# EasyEDA schematic diagram.json
TITLE: 控制面板; REV: 1.0; Date: 2023-10-11; Sheet: 1/1; Drawn By: ltw8086; Company: OIer-Meet Team
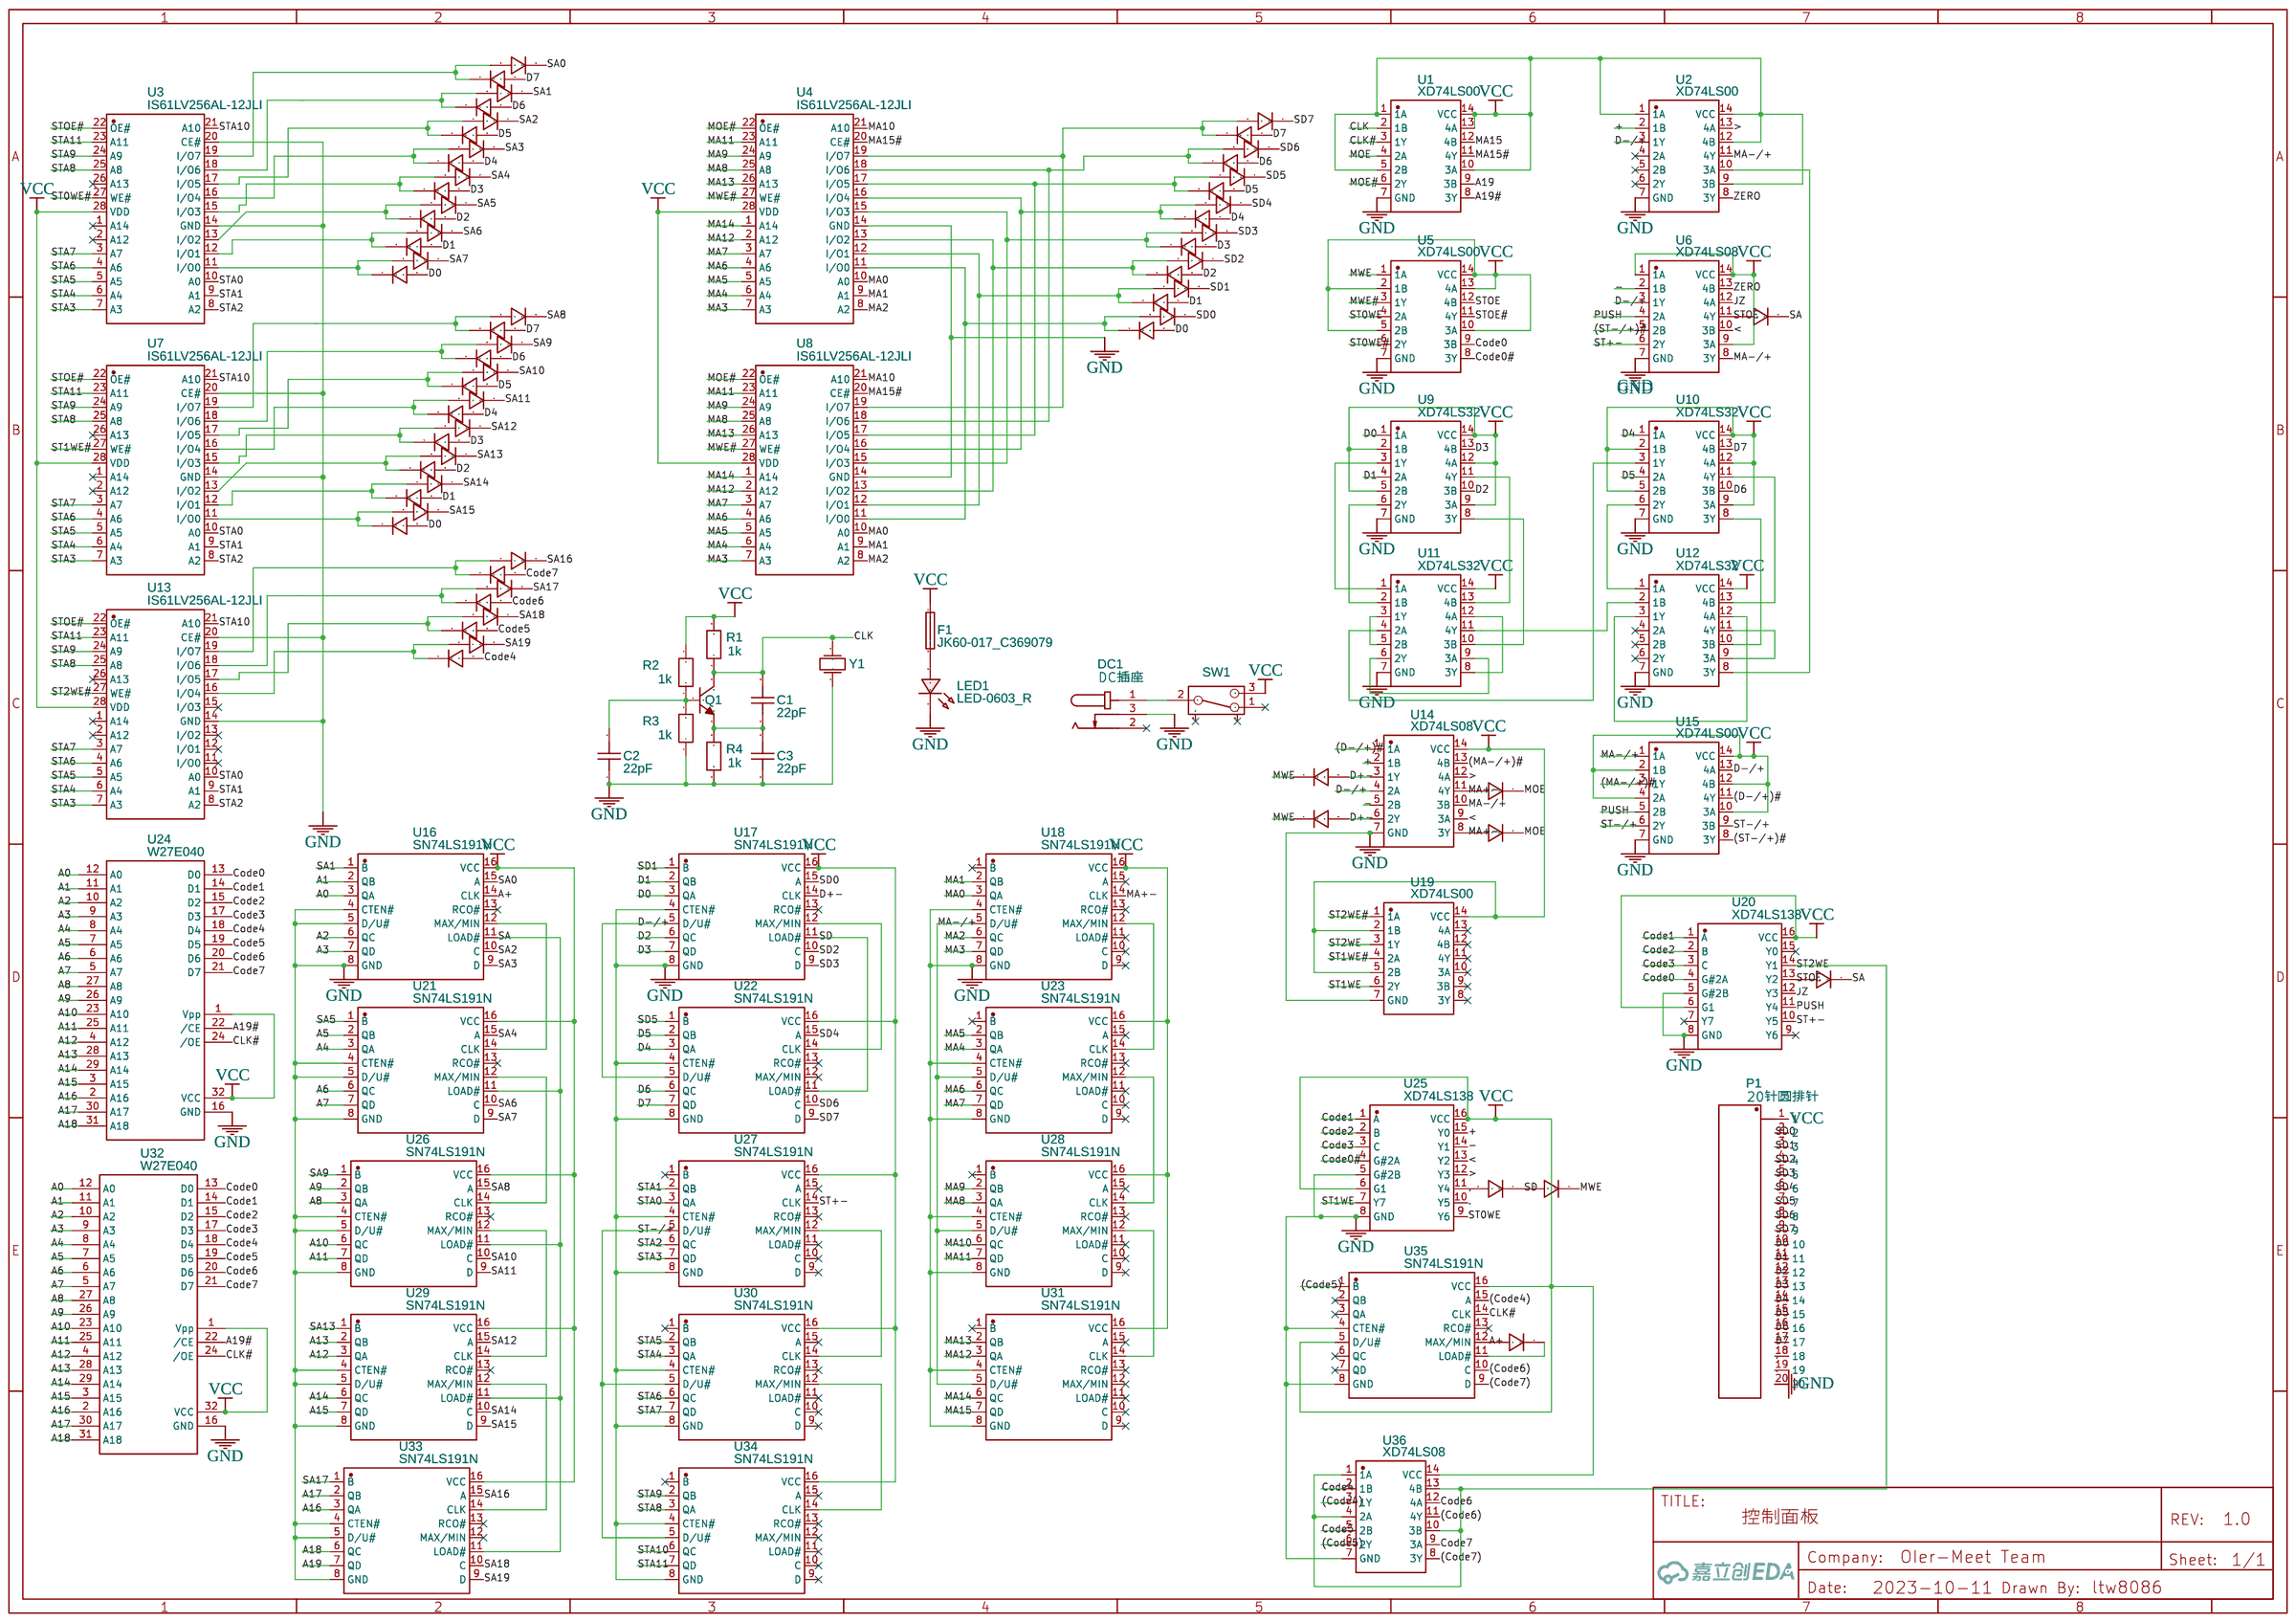
[diagram p0: schematic sheet]

## Parts
C1  22pF  [RAD-0.1]
C2  22pF  [RAD-0.1]
C3  22pF  [RAD-0.1]
D1  1N4148  [DO-35_BD2.0-L4.2-P8.20-D0.5-RD]
D2  1N4148  [DO-35_BD2.0-L4.2-P8.20-D0.5-RD]
D3  1N4148  [DO-35_BD2.0-L4.2-P8.20-D0.5-RD]
D4  1N4148  [DO-35_BD2.0-L4.2-P8.20-D0.5-RD]
D5  1N4148  [DO-35_BD2.0-L4.2-P8.20-D0.5-RD]
D6  1N4148  [DO-35_BD2.0-L4.2-P8.20-D0.5-RD]
D7  1N4148  [DO-35_BD2.0-L4.2-P8.20-D0.5-RD]
D8  1N4148  [DO-35_BD2.0-L4.2-P8.20-D0.5-RD]
D9  1N4148  [DO-35_BD2.0-L4.2-P8.20-D0.5-RD]
D10  1N4148  [DO-35_BD2.0-L4.2-P8.20-D0.5-RD]
D11  1N4148  [DO-35_BD2.0-L4.2-P8.20-D0.5-RD]
D12  1N4148  [DO-35_BD2.0-L4.2-P8.20-D0.5-RD]
D13  1N4148  [DO-35_BD2.0-L4.2-P8.20-D0.5-RD]
D14  1N4148  [DO-35_BD2.0-L4.2-P8.20-D0.5-RD]
D15  1N4148  [DO-35_BD2.0-L4.2-P8.20-D0.5-RD]
D16  1N4148  [DO-35_BD2.0-L4.2-P8.20-D0.5-RD]
D17  1N4148  [DO-35_BD2.0-L4.2-P8.20-D0.5-RD]
D18  1N4148  [DO-35_BD2.0-L4.2-P8.20-D0.5-RD]
D19  1N4148  [DO-35_BD2.0-L4.2-P8.20-D0.5-RD]
D20  1N4148  [DO-35_BD2.0-L4.2-P8.20-D0.5-RD]
D21  1N4148  [DO-35_BD2.0-L4.2-P8.20-D0.5-RD]
D22  1N4148  [DO-35_BD2.0-L4.2-P8.20-D0.5-RD]
D23  1N4148  [DO-35_BD2.0-L4.2-P8.20-D0.5-RD]
D24  1N4148  [DO-35_BD2.0-L4.2-P8.20-D0.5-RD]
D25  1N4148  [DO-35_BD2.0-L4.2-P8.20-D0.5-RD]
D26  1N4148  [DO-35_BD2.0-L4.2-P8.20-D0.5-RD]
D27  1N4148  [DO-35_BD2.0-L4.2-P8.20-D0.5-RD]
D28  1N4148  [DO-35_BD2.0-L4.2-P8.20-D0.5-RD]
D29  1N4148  [DO-35_BD2.0-L4.2-P8.20-D0.5-RD]
D30  1N4148  [DO-35_BD2.0-L4.2-P8.20-D0.5-RD]
D31  1N4148  [DO-35_BD2.0-L4.2-P8.20-D0.5-RD]
D32  1N4148  [DO-35_BD2.0-L4.2-P8.20-D0.5-RD]
D33  1N4148  [DO-35_BD2.0-L4.2-P8.20-D0.5-RD]
D34  1N4148  [DO-35_BD2.0-L4.2-P8.20-D0.5-RD]
D35  1N4148  [DO-35_BD2.0-L4.2-P8.20-D0.5-RD]
D36  1N4148  [DO-35_BD2.0-L4.2-P8.20-D0.5-RD]
D37  1N4148  [DO-35_BD2.0-L4.2-P8.20-D0.5-RD]
D38  1N4148  [DO-35_BD2.0-L4.2-P8.20-D0.5-RD]
D39  1N4148  [DO-35_BD2.0-L4.2-P8.20-D0.5-RD]
D40  1N4148  [DO-35_BD2.0-L4.2-P8.20-D0.5-RD]
D41  1N4148  [DO-35_BD2.0-L4.2-P8.20-D0.5-RD]
D42  1N4148  [DO-35_BD2.0-L4.2-P8.20-D0.5-RD]
D43  1N4148  [DO-35_BD2.0-L4.2-P8.20-D0.5-RD]
D44  1N4148  [DO-35_BD2.0-L4.2-P8.20-D0.5-RD]
D45  1N4148  [DO-35_BD2.0-L4.2-P8.20-D0.5-RD]
D46  1N4148  [DO-35_BD2.0-L4.2-P8.20-D0.5-RD]
D47  1N4148  [DO-35_BD2.0-L4.2-P8.20-D0.5-RD]
D48  1N4148  [DO-35_BD2.0-L4.2-P8.20-D0.5-RD]
D49  1N4148  [DO-35_BD2.0-L4.2-P8.20-D0.5-RD]
D50  1N4148  [DO-35_BD2.0-L4.2-P8.20-D0.5-RD]
D51  1N4148  [DO-35_BD2.0-L4.2-P8.20-D0.5-RD]
D52  1N4148  [DO-35_BD2.0-L4.2-P8.20-D0.5-RD]
D53  1N4148  [DO-35_BD2.0-L4.2-P8.20-D0.5-RD]
D54  1N4148  [DO-35_BD2.0-L4.2-P8.20-D0.5-RD]
D55  1N4148  [DO-35_BD2.0-L4.2-P8.20-D0.5-RD]
D56  1N4148  [DO-35_BD2.0-L4.2-P8.20-D0.5-RD]
D57  1N4148  [DO-35_BD2.0-L4.2-P8.20-D0.5-RD]
D58  1N4148  [DO-35_BD2.0-L4.2-P8.20-D0.5-RD]
D62  1N4148  [DO-35_BD2.0-L4.2-P8.20-D0.5-RD]
D63  1N4148  [DO-35_BD2.0-L4.2-P8.20-D0.5-RD]
D64  1N4148  [DO-35_BD2.0-L4.2-P8.20-D0.5-RD]
D65  1N4148  [DO-35_BD2.0-L4.2-P8.20-D0.5-RD]
D66  1N4148  [DO-35_BD2.0-L4.2-P8.20-D0.5-RD]
D67  1N4148  [DO-35_BD2.0-L4.2-P8.20-D0.5-RD]
D68  1N4148  [DO-35_BD2.0-L4.2-P8.20-D0.5-RD]
DC1  DC插座  [DC-IN-TH_DC-005-5A-2.0]
F1  JK60-017_C369079  [FUSE-TH_L7.4-W3.0-P5.10-D0.5-S2.00]
LED1  LED-0603_R  [LED-TH_2P-L4.80-W3.80-P2.54-L]
P1  20针圆排针  [20针排针]
Q1  2N3904(TO-92)  [TO-92-3_L5.1-W4.1-P1.27-L]
R1  1k  [R_AXIAL-0.3]
R2  1k  [R_AXIAL-0.3]
R3  1k  [R_AXIAL-0.3]
R4  1k  [R_AXIAL-0.3]
SW1  SK-12D02-VG5  [SW-TH_SK-12D02VG3]
U1  XD74LS00  [DIP-14_L20.0-W7.6-P2.54-LS7.6-BL]
U2  XD74LS00  [DIP-14_L20.0-W7.6-P2.54-LS7.6-BL]
U3  IS61LV256AL-12JLI  [TSOP-28_L11.8-W8.0-P0.55-LS13.4-L]
U4  IS61LV256AL-12JLI  [TSOP-28_L11.8-W8.0-P0.55-LS13.4-L]
U5  XD74LS00  [DIP-14_L20.0-W7.6-P2.54-LS7.6-BL]
U6  XD74LS08  [DIP-14_L19.4-W6.4-P2.54-LS7.6-BL]
U7  IS61LV256AL-12JLI  [TSOP-28_L11.8-W8.0-P0.55-LS13.4-L]
U8  IS61LV256AL-12JLI  [TSOP-28_L11.8-W8.0-P0.55-LS13.4-L]
U9  XD74LS32  [DIP-14_L18.9-W6.4-P2.54-LS7.6-BL]
U10  XD74LS32  [DIP-14_L18.9-W6.4-P2.54-LS7.6-BL]
U11  XD74LS32  [DIP-14_L18.9-W6.4-P2.54-LS7.6-BL]
U12  XD74LS32  [DIP-14_L18.9-W6.4-P2.54-LS7.6-BL]
U13  IS61LV256AL-12JLI  [TSOP-28_L11.8-W8.0-P0.55-LS13.4-L]
U14  XD74LS08  [DIP-14_L19.4-W6.4-P2.54-LS7.6-BL]
U15  XD74LS00  [DIP-14_L20.0-W7.6-P2.54-LS7.6-BL]
U16  SN74LS191N  [PDIP-16_L19.3-W6.4-P2.54-LS7.94-BL]
U17  SN74LS191N  [PDIP-16_L19.3-W6.4-P2.54-LS7.94-BL]
U18  SN74LS191N  [PDIP-16_L19.3-W6.4-P2.54-LS7.94-BL]
U19  XD74LS00  [DIP-14_L20.0-W7.6-P2.54-LS7.6-BL]
U20  XD74LS138  [DIP-16_L19.8-W6.5-P2.54-LS7.6-BL]
U21  SN74LS191N  [PDIP-16_L19.3-W6.4-P2.54-LS7.94-BL]
U22  SN74LS191N  [PDIP-16_L19.3-W6.4-P2.54-LS7.94-BL]
U23  SN74LS191N  [PDIP-16_L19.3-W6.4-P2.54-LS7.94-BL]
U24  W27E040  [DIP32]
U25  XD74LS138  [DIP-16_L19.8-W6.5-P2.54-LS7.6-BL]
U26  SN74LS191N  [PDIP-16_L19.3-W6.4-P2.54-LS7.94-BL]
U27  SN74LS191N  [PDIP-16_L19.3-W6.4-P2.54-LS7.94-BL]
U28  SN74LS191N  [PDIP-16_L19.3-W6.4-P2.54-LS7.94-BL]
U29  SN74LS191N  [PDIP-16_L19.3-W6.4-P2.54-LS7.94-BL]
U30  SN74LS191N  [PDIP-16_L19.3-W6.4-P2.54-LS7.94-BL]
U31  SN74LS191N  [PDIP-16_L19.3-W6.4-P2.54-LS7.94-BL]
U32  W27E040  [DIP32]
U33  SN74LS191N  [PDIP-16_L19.3-W6.4-P2.54-LS7.94-BL]
U34  SN74LS191N  [PDIP-16_L19.3-W6.4-P2.54-LS7.94-BL]
U35  SN74LS191N  [PDIP-16_L19.3-W6.4-P2.54-LS7.94-BL]
U36  XD74LS08  [DIP-14_L19.4-W6.4-P2.54-LS7.6-BL]
Y1  16Mhz 晶振  [晶振]

## Library data of the parts
C1-C3 = C_RAD-0.2_US: Contributor: LCEDA_Lib; Package Display: No
D1 D3 D5 D6 D9 D10 D13 D14 D17 D18 D21 D22 D25 D26 D29 D31 D32 D35 D37 D39 D41 D43 D45 D47 D49 D51 D53 D55 D62-D65 D67 = 1N4007: Supplier: LCSC; Manufacturer: STMicroelectronics; Supplier Part: C13769; Contributor: LCEDA_Lib
D2 D4 D7 D8 D11 D12 D15 D16 D19 D20 D23 D24 D27 D28 D30 D33 D34 D36 D38 D40 D42 D44 D46 D48 D50 D52 D54 D56-D58 D66 D68 = 1N4148: Supplier: LCSC; Supplier Part: C13769; Manufacturer: STMicroelectronics; Contributor: LCSC
DC1 = DC插座: Supplier: LCSC; Supplier Part: C381116; Manufacturer: XKB Enterprise; Manufacturer Part: DC-005-5A-2.0; Contributor: erhuoyan
F1 = JK60-017_C369079: Contributor: LCSC; Supplier: LCSC; Supplier Part: C369079; Manufacturer: JK(金科); Manufacturer Part: JK60-017; JLCPCB Part Class: Extended Part; link: https://so.szlcsc.com/global.html?k=C369079&ref=editor
LED1 = LED-0603_R: Manufacturer: EVERLIGHT(台湾亿光); Manufacturer Part: 19-217/R6C-AL1M2VY/3T; Supplier Part: C72044; Supplier: LCSC; Contributor: LCEDA_01
P1 = 20针圆排针: Supplier Part: C9742; Supplier: LCSC; Manufacturer: BOOMELE; Contributor: dengke
Q1 = 2N3904(TO-92): Supplier: LCSC; Manufacturer: SEMTECH; Manufacturer Part: 2N3904; Supplier Part: C118538; Contributor: LCEDA_Lib
R1-R4 = R_AXIAL-0.8_EU: Contributor: LCEDA_Lib
SW1 = SK-12D02-VG5: Supplier: LCSC; Supplier Part: C136722; Manufacturer: Rectangular Connectors - Contacts; Contributor: LCSC
U1 U2 U5 U15 U19 = XD74LS00: Contributor: LCSC; Supplier: LCSC; Supplier Part: C556265; Manufacturer: XINLUDA(信路达); JLCPCB Part Class: Extended Part; link: https://so.szlcsc.com/global.html?k=C556265&ref=editor
U3 U4 U7 U8 U13 = IS61LV256AL-10TLI: Contributor: LCSC; Supplier: LCSC; Supplier Part: C412837; Manufacturer: ISSI(美国芯成); JLCPCB Part Class: Extended Part; Package Display: No
U6 U14 U36 = XD74LS08: Contributor: LCSC; Supplier: LCSC; Supplier Part: C521139; Manufacturer: XINLUDA(信路达); JLCPCB Part Class: Extended Part; link: https://so.szlcsc.com/global.html?k=C521139&ref=editor
U9-U12 = XD74LS32: Contributor: LCSC; Supplier: LCSC; Supplier Part: C521170; Manufacturer: XINLUDA(信路达); JLCPCB Part Class: Extended Part; link: https://so.szlcsc.com/global.html?k=C521170&ref=editor
U16-U18 U21-U23 U26-U31 U33-U35 = SN74LS191N: Contributor: LCSC; Supplier: LCSC; Supplier Part: C1523316; Manufacturer: TI(德州仪器); link: https://so.szlcsc.com/global.html?k=C1523316&ref=editor
U20 U25 = XD74LS138: Contributor: LCSC; Supplier: LCSC; Supplier Part: C513527; Manufacturer: XINLUDA; JLCPCB Part Class: Extended Part; link: https://so.szlcsc.com/global.html?k=C513527&ref=editor
U24 U32 = W27E040: Contributor: 401567A
Y1 = 晶振: Contributor: yxy20

## Nets
GND: C2.1 C3.1 DC1.3 LED1.2 P1.20 R3.1 R4.1 U1.7(GND) U2.7(GND) U3.14(GND) U3.20(CE#) U4.14(GND) U5.7(GND) U6.7(GND) U7.14(GND) U7.20(CE#) U8.14(GND) U9.7(GND) U10.7(GND) U11.7(GND) U12.7(GND) U13.14(GND) U13.20(CE#) U14.7(GND) U15.7(GND) U16.4(CTEN#) U16.5(D/U#) U16.8(GND) U17.4(CTEN#) U17.8(GND) U18.4(CTEN#) U18.8(GND) U19.7(GND) U20.5(G#2B) U20.8(GND) U21.4(CTEN#) U21.5(D/U#) U21.8(GND) U22.4(CTEN#) U22.8(GND) U23.4(CTEN#) U23.8(GND) U24.16(GND) U25.5(G#2B) U25.8(GND) U26.4(CTEN#) U26.5(D/U#) U26.8(GND) U27.4(CTEN#) U27.8(GND) U28.4(CTEN#) U28.8(GND) U29.4(CTEN#) U29.5(D/U#) U29.8(GND) U30.4(CTEN#) U30.8(GND) U31.4(CTEN#) U31.8(GND) U32.16(GND) U33.4(CTEN#) U33.5(D/U#) U33.8(GND) U34.4(CTEN#) U34.8(GND) U35.4(CTEN#) U35.8(GND) U36.7(GND) Y1.1(P1)
VCC: F1.1 P1.1 R1.2 R2.2 SW1.3 U1.1(1A) U1.5(2B) U1.10(3A) U1.13(4A) U1.14(VCC) U2.1(1A) U2.9(3B) U2.12(4B) U2.14(VCC) U3.28(VDD) U4.28(VDD) U5.2(1B) U5.5(2B) U5.10(3A) U5.13(4A) U5.14(VCC) U6.1(1A) U6.9(3A) U6.14(VCC) U7.28(VDD) U8.28(VDD) U9.2(1B) U9.5(2B) U9.9(3A) U9.12(4A) U9.14(VCC) U10.2(1B) U10.5(2B) U10.9(3A) U10.12(4A) U10.14(VCC) U11.14(VCC) U12.14(VCC) U13.28(VDD) U14.14(VCC) U15.2(1B) U15.4(2A) U15.10(3A) U15.12(4B) U15.14(VCC) U16.16(VCC) U17.16(VCC) U18.16(VCC) U19.2(1B) U19.5(2B) U19.14(VCC) U20.6(G1) U20.16(VCC) U21.16(VCC) U22.16(VCC) U23.16(VCC) U24.1(Vpp) U24.32(VCC) U25.6(G1) U25.16(VCC) U26.16(VCC) U27.16(VCC) U28.16(VCC) U29.16(VCC) U30.16(VCC) U31.16(VCC) U32.1(Vpp) U32.32(VCC) U33.16(VCC) U34.16(VCC) U35.5(D/U#) U35.16(VCC) U36.14(VCC)
(Code4): U35.15(A) U36.3(1Y)
(Code5): U35.1(B) U36.6(2Y)
(Code6): U35.10(C) U36.11(4Y)
(Code7): U35.9(D) U36.8(3Y)
(D-/+)#: U14.1(1A) U15.11(4Y)
(MA-/+)#: U14.13(4B) U15.3(1Y)
(ST-/+)#: U6.5(2B) U15.8(3Y)
+: U2.2(1B) U14.2(1B) U25.15(Y0)
,: D62.2 P1.18 U25.11(Y4)
-: U6.2(1B) U14.5(2B) U25.14(Y1)
.: P1.19 U25.10(Y5)
<: U6.10(3B) U14.9(3A) U25.13(Y2)
>: U2.13(4A) U14.12(4A) U25.12(Y3)
A0: U16.3(QA) U24.12(A0) U32.12(A0)
A1: U16.2(QB) U24.11(A1) U32.11(A1)
A2: U16.6(QC) U24.10(A2) U32.10(A2)
A3: U16.7(QD) U24.9(A3) U32.9(A3)
A4: U21.3(QA) U24.8(A4) U32.8(A4)
A5: U21.2(QB) U24.7(A5) U32.7(A5)
A6: U21.6(QC) U24.6(A6) U32.6(A6)
A7: U21.7(QD) U24.5(A7) U32.5(A7)
A8: U24.27(A8) U26.3(QA) U32.27(A8)
A9: U24.26(A9) U26.2(QB) U32.26(A9)
A10: U24.23(A10) U26.6(QC) U32.23(A10)
A11: U24.25(A11) U26.7(QD) U32.25(A11)
A12: U24.4(A12) U29.3(QA) U32.4(A12)
A13: U24.28(A13) U29.2(QB) U32.28(A13)
A14: U24.29(A14) U29.6(QC) U32.29(A14)
A15: U24.3(A15) U29.7(QD) U32.3(A15)
A16: U24.2(A16) U32.2(A16) U33.3(QA)
A17: U24.30(A17) U32.30(A17) U33.2(QB)
A18: U24.31(A18) U32.31(A18) U33.6(QC)
A19: U1.9(3B) U33.7(QD)
A19#: U1.8(3Y) U24.22(/CE) U32.22(/CE)
A+: D65.2 U16.14(CLK) U35.12(MAX/MIN)
CLK: C1.2 Q1.3(C) R1.1 U1.2(1B) Y1.2(P2)
CLK#: U1.3(1Y) U24.24(/OE) U32.24(/OE) U35.14(CLK)
Code0: U5.9(3B) U20.4(G#2A) U24.13(D0) U32.13(D0)
Code0#: U5.8(3Y) U25.4(G#2A)
Code1: U20.1(A) U24.14(D1) U25.1(A) U32.14(D1)
Code2: U20.2(B) U24.15(D2) U25.2(B) U32.15(D2)
Code3: U20.3(C) U24.17(D3) U25.3(C) U32.17(D3)
Code4: D56.2 U24.18(D4) U32.18(D4) U36.2(1B)
Code5: D54.2 U24.19(D5) U32.19(D5) U36.5(2B)
Code6: D52.2 U24.20(D6) U32.20(D6) U36.12(4A)
Code7: D50.2 U24.21(D7) U32.21(D7) U36.9(3A)
D0: D27.2 D34.2 D48.2 P1.10 U9.1(1A) U17.3(QA)
D1: D23.2 D30.2 D46.2 P1.11 U9.4(2A) U17.2(QB)
D2: D19.2 D28.2 D44.2 P1.12 U9.10(3B) U17.6(QC)
D3: D15.2 D24.2 D42.2 P1.13 U9.13(4B) U17.7(QD)
D4: D11.2 D20.2 D40.2 P1.14 U10.1(1A) U22.3(QA)
D5: D7.2 D16.2 D38.2 P1.15 U10.4(2A) U22.2(QB)
D6: D4.2 D12.2 D36.2 P1.16 U10.10(3B) U22.6(QC)
D7: D2.2 D8.2 D33.2 P1.17 U10.13(4B) U22.7(QD)
D+-: D57.2 D58.2 U14.3(1Y) U14.6(2Y) U17.14(CLK)
D-/+: U2.3(1Y) U6.3(1Y) U14.4(2A) U15.13(4A) U17.5(D/U#) U22.5(D/U#)
JZ: U6.12(4A) U20.12(Y3)
MA0: U4.10(A0) U8.10(A0) U18.3(QA)
MA1: U4.9(A1) U8.9(A1) U18.2(QB)
MA2: U4.8(A2) U8.8(A2) U18.6(QC)
MA3: U4.7(A3) U8.7(A3) U18.7(QD)
MA4: U4.6(A4) U8.6(A4) U23.3(QA)
MA5: U4.5(A5) U8.5(A5) U23.2(QB)
MA6: U4.4(A6) U8.4(A6) U23.6(QC)
MA7: U4.3(A7) U8.3(A7) U23.7(QD)
MA8: U4.25(A8) U8.25(A8) U28.3(QA)
MA9: U4.24(A9) U8.24(A9) U28.2(QB)
MA10: U4.21(A10) U8.21(A10) U28.6(QC)
MA11: U4.23(A11) U8.23(A11) U28.7(QD)
MA12: U4.2(A12) U8.2(A12) U31.3(QA)
MA13: U4.26(A13) U8.26(A13) U31.2(QB)
MA14: U4.1(A14) U8.1(A14) U31.6(QC)
MA15: U1.12(4B) U31.7(QD)
MA15#: U1.11(4Y) U4.20(CE#) U8.20(CE#)
MA+-: D63.2 D64.2 U14.8(3Y) U14.11(4Y) U18.14(CLK)
MA-/+: U2.11(4Y) U6.8(3Y) U14.10(3B) U15.1(1A) U18.5(D/U#) U23.5(D/U#) U28.5(D/U#) U31.5(D/U#)
MOE: D63.1 D64.1 U1.4(2A)
MOE#: U1.6(2Y) U4.22(OE#) U8.22(OE#)
MWE: D57.1 D58.1 D67.1 U5.1(1A)
MWE#: U4.27(WE#) U5.3(1Y) U8.27(WE#)
PUSH: U6.4(2A) U15.5(2B) U20.11(Y4)
SA: D66.1 D68.1 U16.11(LOAD#) U21.11(LOAD#) U26.11(LOAD#) U29.11(LOAD#) U33.11(LOAD#)
SA0: D1.1 U16.15(A)
SA1: D3.1 U16.1(B)
SA2: D5.1 U16.10(C)
SA3: D9.1 U16.9(D)
SA4: D13.1 U21.15(A)
SA5: D17.1 U21.1(B)
SA6: D21.1 U21.10(C)
SA7: D25.1 U21.9(D)
SA8: D31.1 U26.15(A)
SA9: D35.1 U26.1(B)
SA10: D37.1 U26.10(C)
SA11: D39.1 U26.9(D)
SA12: D41.1 U29.15(A)
SA13: D43.1 U29.1(B)
SA14: D45.1 U29.10(C)
SA15: D47.1 U29.9(D)
SA16: D49.1 U33.15(A)
SA17: D51.1 U33.1(B)
SA18: D53.1 U33.10(C)
SA19: D55.1 U33.9(D)
SD: D62.1 D67.2 U17.11(LOAD#) U22.11(LOAD#)
SD0: D32.1 P1.2 U17.15(A)
SD1: D29.1 P1.3 U17.1(B)
SD2: D26.1 P1.4 U17.10(C)
SD3: D22.1 P1.5 U17.9(D)
SD4: D18.1 P1.6 U22.15(A)
SD5: D14.1 P1.7 U22.1(B)
SD6: D10.1 P1.8 U22.10(C)
SD7: D6.1 P1.9 U22.9(D)
ST0WE: U5.4(2A) U25.9(Y6)
ST0WE#: U3.27(WE#) U5.6(2Y)
ST1WE: U19.6(2Y) U25.7(Y7)
ST1WE#: U7.27(WE#) U19.4(2A)
ST2WE: U19.3(1Y) U20.14(Y1) U36.1(1A) U36.4(2A) U36.10(3B) U36.13(4B)
ST2WE#: U13.27(WE#) U19.1(1A)
ST+-: U6.6(2Y) U20.10(Y5) U27.14(CLK)
ST-/+: U15.6(2Y) U15.9(3B) U27.5(D/U#) U30.5(D/U#) U34.5(D/U#)
STA0: U3.10(A0) U7.10(A0) U13.10(A0) U27.3(QA)
STA1: U3.9(A1) U7.9(A1) U13.9(A1) U27.2(QB)
STA2: U3.8(A2) U7.8(A2) U13.8(A2) U27.6(QC)
STA3: U3.7(A3) U7.7(A3) U13.7(A3) U27.7(QD)
STA4: U3.6(A4) U7.6(A4) U13.6(A4) U30.3(QA)
STA5: U3.5(A5) U7.5(A5) U13.5(A5) U30.2(QB)
STA6: U3.4(A6) U7.4(A6) U13.4(A6) U30.6(QC)
STA7: U3.3(A7) U7.3(A7) U13.3(A7) U30.7(QD)
STA8: U3.25(A8) U7.25(A8) U13.25(A8) U34.3(QA)
STA9: U3.24(A9) U7.24(A9) U13.24(A9) U34.2(QB)
STA10: U3.21(A10) U7.21(A10) U13.21(A10) U34.6(QC)
STA11: U3.23(A11) U7.23(A11) U13.23(A11) U34.7(QD)
STOE: D66.2 D68.2 U5.12(4B) U6.11(4Y) U20.13(Y2)
STOE#: U3.22(OE#) U5.11(4Y) U7.22(OE#) U13.22(OE#)
ZERO: U2.8(3Y) U6.13(4B)
Net-(C1-1): C1.1 C3.2 Q1.1(E) R4.2
Net-(C2-2): C2.2 Q1.2(B) R2.1 R3.2
Net-(D1-2): D1.2 D2.1 U3.19(I/O7)
Net-(D3-2): D3.2 D4.1 U3.18(I/O6)
Net-(D5-2): D5.2 D7.1 U3.17(I/O5)
Net-(D6-2): D6.2 D8.1 U4.19(I/O7) U8.19(I/O7)
Net-(D9-2): D9.2 D11.1 U3.16(I/O4)
Net-(D10-2): D10.2 D12.1 U4.18(I/O6) U8.18(I/O6)
Net-(D13-2): D13.2 D15.1 U3.15(I/O3)
Net-(D14-2): D14.2 D16.1 U4.17(I/O5) U8.17(I/O5)
Net-(D17-2): D17.2 D19.1 U3.13(I/O2)
Net-(D18-2): D18.2 D20.1 U4.16(I/O4) U8.16(I/O4)
Net-(D21-2): D21.2 D23.1 U3.12(I/O1)
Net-(D22-2): D22.2 D24.1 U4.15(I/O3) U8.15(I/O3)
Net-(D25-2): D25.2 D27.1 U3.11(I/O0)
Net-(D26-2): D26.2 D28.1 U4.13(I/O2) U8.13(I/O2)
Net-(D29-2): D29.2 D30.1 U4.12(I/O1) U8.12(I/O1)
Net-(D31-2): D31.2 D33.1 U7.19(I/O7)
Net-(D32-2): D32.2 D34.1 U4.11(I/O0) U8.11(I/O0)
Net-(D35-2): D35.2 D36.1 U7.18(I/O6)
Net-(D37-2): D37.2 D38.1 U7.17(I/O5)
Net-(D39-2): D39.2 D40.1 U7.16(I/O4)
Net-(D41-2): D41.2 D42.1 U7.15(I/O3)
Net-(D43-2): D43.2 D44.1 U7.13(I/O2)
Net-(D45-2): D45.2 D46.1 U7.12(I/O1)
Net-(D47-2): D47.2 D48.1 U7.11(I/O0)
Net-(D49-2): D49.2 D50.1 U13.19(I/O7)
Net-(D51-2): D51.2 D52.1 U13.18(I/O6)
Net-(D53-2): D53.2 D54.1 U13.17(I/O5)
Net-(D55-2): D55.2 D56.1 U13.16(I/O4)
Net-(D65-1): D65.1 U35.11(LOAD#)
Net-(DC1-1): DC1.1 SW1.2
Net-(F1-2): F1.2 LED1.1
Net-(U2-10): U2.10(3A) U12.8(3Y)
Net-(U9-3): U9.3(1Y) U11.1(1A)
Net-(U9-6): U9.6(2Y) U11.2(1B)
Net-(U9-8): U9.8(3Y) U11.10(3B)
Net-(U9-11): U9.11(4Y) U11.13(4B)
Net-(U10-3): U10.3(1Y) U11.4(2A)
Net-(U10-6): U10.6(2Y) U12.1(1A)
Net-(U10-8): U10.8(3Y) U12.10(3B)
Net-(U10-11): U10.11(4Y) U12.13(4B)
Net-(U11-3): U11.3(1Y) U11.5(2B)
Net-(U11-6): U11.6(2Y) U11.9(3A)
Net-(U11-8): U11.8(3Y) U11.12(4A)
Net-(U11-11): U11.11(4Y) U12.2(1B)
Net-(U12-3): U12.3(1Y) U12.12(4A)
Net-(U12-9): U12.9(3A) U12.11(4Y)
Net-(U16-12): U16.12(MAX/MIN) U21.14(CLK)
Net-(U17-12): U17.12(MAX/MIN) U22.14(CLK)
Net-(U18-12): U18.12(MAX/MIN) U23.14(CLK)
Net-(U21-12): U21.12(MAX/MIN) U26.14(CLK)
Net-(U23-12): U23.12(MAX/MIN) U28.14(CLK)
Net-(U26-12): U26.12(MAX/MIN) U29.14(CLK)
Net-(U27-12): U27.12(MAX/MIN) U30.14(CLK)
Net-(U28-12): U28.12(MAX/MIN) U31.14(CLK)
Net-(U29-12): U29.12(MAX/MIN) U33.14(CLK)
Net-(U30-12): U30.12(MAX/MIN) U34.14(CLK)

Not connected (* = marked no-connect by the designer): DC1 2*; SW1 1* 4* 5*; U2 4(2A)* 5(2B)* 6(2Y)*; U3 1(A14)* 2(A12)* 26(A13)*; U7 1(A14)* 2(A12)* 26(A13)*; U12 4(2A)* 5(2B)* 6(2Y)*; U13 1(A14)* 2(A12)* 11(I/O0)* 12(I/O1)* 13(I/O2)* 15(I/O3)* 26(A13)*; U16 13(RCO#)*; U17 13(RCO#)*; U18 1(B)* 9(D)* 10(C)* 11(LOAD#)* 13(RCO#)* 15(A)*; U19 8(3Y)* 9(3B)* 10(3A)* 11(4Y)* 12(4B)* 13(4A)*; U20 7(Y7)* 9(Y6)* 15(Y0)*; U21 13(RCO#)*; U22 12(MAX/MIN)* 13(RCO#)*; U23 1(B)* 9(D)* 10(C)* 11(LOAD#)* 13(RCO#)* 15(A)*; U26 13(RCO#)*; U27 1(B)* 9(D)* 10(C)* 11(LOAD#)* 13(RCO#)* 15(A)*; U28 1(B)* 9(D)* 10(C)* 11(LOAD#)* 13(RCO#)* 15(A)*; U29 13(RCO#)*; U30 1(B)* 9(D)* 10(C)* 11(LOAD#)* 13(RCO#)* 15(A)*; U31 1(B)* 9(D)* 10(C)* 11(LOAD#)* 12(MAX/MIN)* 13(RCO#)* 15(A)*; U33 12(MAX/MIN)* 13(RCO#)*; U34 1(B)* 9(D)* 10(C)* 11(LOAD#)* 12(MAX/MIN)* 13(RCO#)* 15(A)*; U35 2(QB)* 3(QA)* 6(QC)* 7(QD)* 13(RCO#)*

## Notes on the sheet
- GND
